# EAGLE design fpv2 (EAGLE 8.4.2)

## Sheet 1 of 2
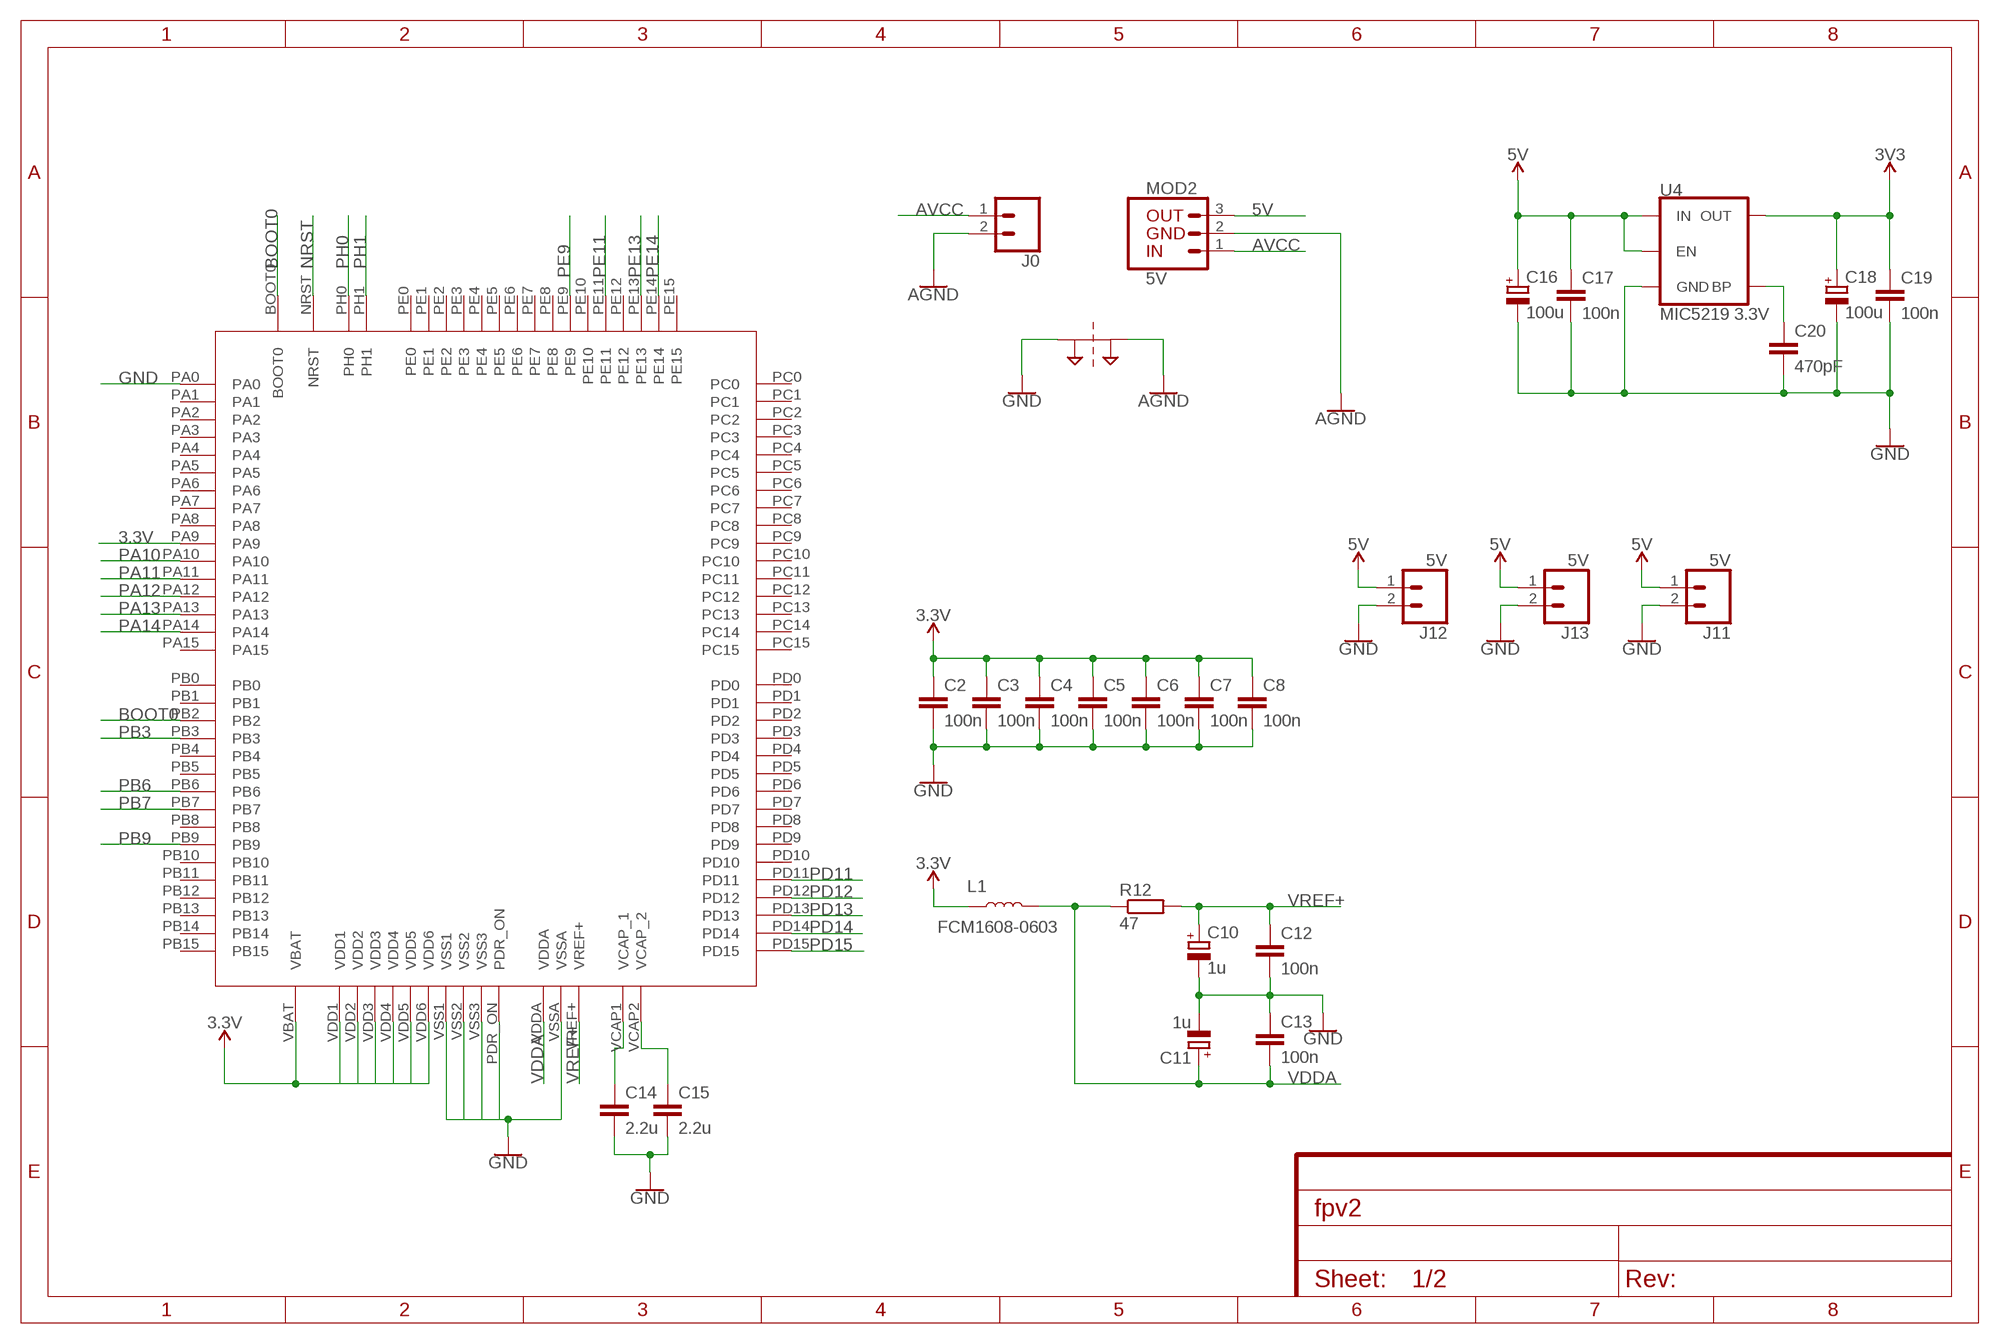
[diagram p0: schematic, sheet 1]

### Parts
C2  100n  C-EUC0603  [C0603]
C3  100n  C-EUC0603  [C0603]
C4  100n  C-EUC0603  [C0603]
C5  100n  C-EUC0603  [C0603]
C6  100n  C-EUC0603  [C0603]
C7  100n  C-EUC0603  [C0603]
C8  100n  C-EUC0603  [C0603]
C10  1u  CPOL-EUA/3216-18R  [A/3216-18R]
C11  1u  CPOL-EUA/3216-18R  [A/3216-18R]
C12  100n  C-EUC0603  [C0603]
C13  100n  C-EUC0603  [C0603]
C14  2.2u  C-EUC1206  [C1206]
C15  2.2u  C-EUC1206  [C1206]
C16  100u  CPOL-EUSMCB  [SMC_B]
C17  100n  C-EUC0603  [C0603]
C18  100u  CPOL-EUSMCB  [SMC_B]
C19  100n  C-EUC0603  [C0603]
C20  470pF  C-EUC0603  [C0603]
J0  CONN_02LOCK_LONGPADS  [1X02_LOCK_LONGPADS]
J11  5V  CONN-02SMD  [SMD]
J12  5V  CONN-02SMD  [SMD]
J13  5V  CONN-02SMD  [SMD]
L1  FCM1608-0603  INDUCTOR-0603-33NH  [0603]
MOD2  5V  TPS-MODULE  [1X03]
R12  47  R-EU_R0603  [R0603]
SUPPLY1  2PT_GND_TIE  [2PT_GND_TIE]
U1  STM32F407VGT6  STM32F4V_100PIN_GENERIC  [LQFP100]
U4  MIC5219 3.3V  V_REG_MIC52193.3V  [SOT23-5]

### Nets
3.3V: C2.1 C3.1 C4.1 C5.1 C6.1 C7.1 C8.1 C18.+ C19.1 L1.1 U1.PA9 U1.VBAT U1.VDD1 U1.VDD2 U1.VDD3 U1.VDD4 U1.VDD5 U1.VDD6 U4.5(OUT) ; supply symbol labelled 3V3 ; also sheet 2
5V: C16.+ C17.1 J11.1 J12.1 J13.1 MOD2.3 U4.1(IN) U4.3(EN) ; also sheet 2
AGND: J0.2 MOD2.2 SUPPLY1.P$2 ; also sheet 2
AVCC: J0.1 MOD2.1 ; also sheet 2
BOOT0: U1.BOOT0 U1.PB2 ; also sheet 2
GND: C2.2 C3.2 C4.2 C5.2 C6.2 C7.2 C8.2 C10.- C11.- C12.2 C13.1 C14.2 C15.2 C16.- C17.2 C18.- C19.2 C20.2 J11.2 J12.2 J13.2 SUPPLY1.P$1 U1.PA0 U1.PDR_ON U1.VSS1 U1.VSS2 U1.VSS3 U1.VSSA U4.2(GND) ; also sheet 2
N$9: C14.1 U1.VCAP1(VCAP_1)
N$10: C15.1 U1.VCAP2(VCAP_2)
N$14: C20.1 U4.4(BP)
NRST: U1.NRST ; also sheet 2
PA10: U1.PA10
PA11: U1.PA11 ; also sheet 2
PA12: U1.PA12 ; also sheet 2
PA13: U1.PA13 ; also sheet 2
PA14: U1.PA14 ; also sheet 2
PB3: U1.PB3 ; also sheet 2
PB6: U1.PB6 ; also sheet 2
PB7: U1.PB7 ; also sheet 2
PB9: U1.PB9 ; also sheet 2
PD11: U1.PD11 ; also sheet 2
PD12: U1.PD12 ; also sheet 2
PD13: U1.PD13 ; also sheet 2
PD14: U1.PD14 ; also sheet 2
PD15: U1.PD15 ; also sheet 2
PE9: U1.PE9 ; also sheet 2
PE11: U1.PE11 ; also sheet 2
PE13: U1.PE13 ; also sheet 2
PE14: U1.PE14 ; also sheet 2
PH0: U1.PH0 ; also sheet 2
PH1: U1.PH1 ; also sheet 2
VDDA: C11.+ C13.2 L1.2 R12.1 U1.VDDA
VREF+: C10.+ C12.1 R12.2 U1.VREF+
Unconnected: U1.PA1 U1.PA2 U1.PA3 U1.PA4 U1.PA5 U1.PA6 U1.PA7 U1.PA8 U1.PA15 U1.PB0 U1.PB1 U1.PB4 U1.PB5 U1.PB8 U1.PB10 U1.PB11 U1.PB12 U1.PB13 U1.PB14 U1.PB15 U1.PC0 U1.PC1 U1.PC2 U1.PC3 U1.PC4 U1.PC5 U1.PC6 U1.PC7 U1.PC8 U1.PC9 U1.PC10 U1.PC11 U1.PC12 U1.PC13 U1.PC14 U1.PC15 U1.PD0 U1.PD1 U1.PD2 U1.PD3 U1.PD4 U1.PD5 U1.PD6 U1.PD7 U1.PD8 U1.PD9 U1.PD10 U1.PE0 U1.PE1 U1.PE2 U1.PE3 U1.PE4 U1.PE5 U1.PE6 U1.PE7 U1.PE8 U1.PE10 U1.PE12 U1.PE15

## Sheet 2 of 2
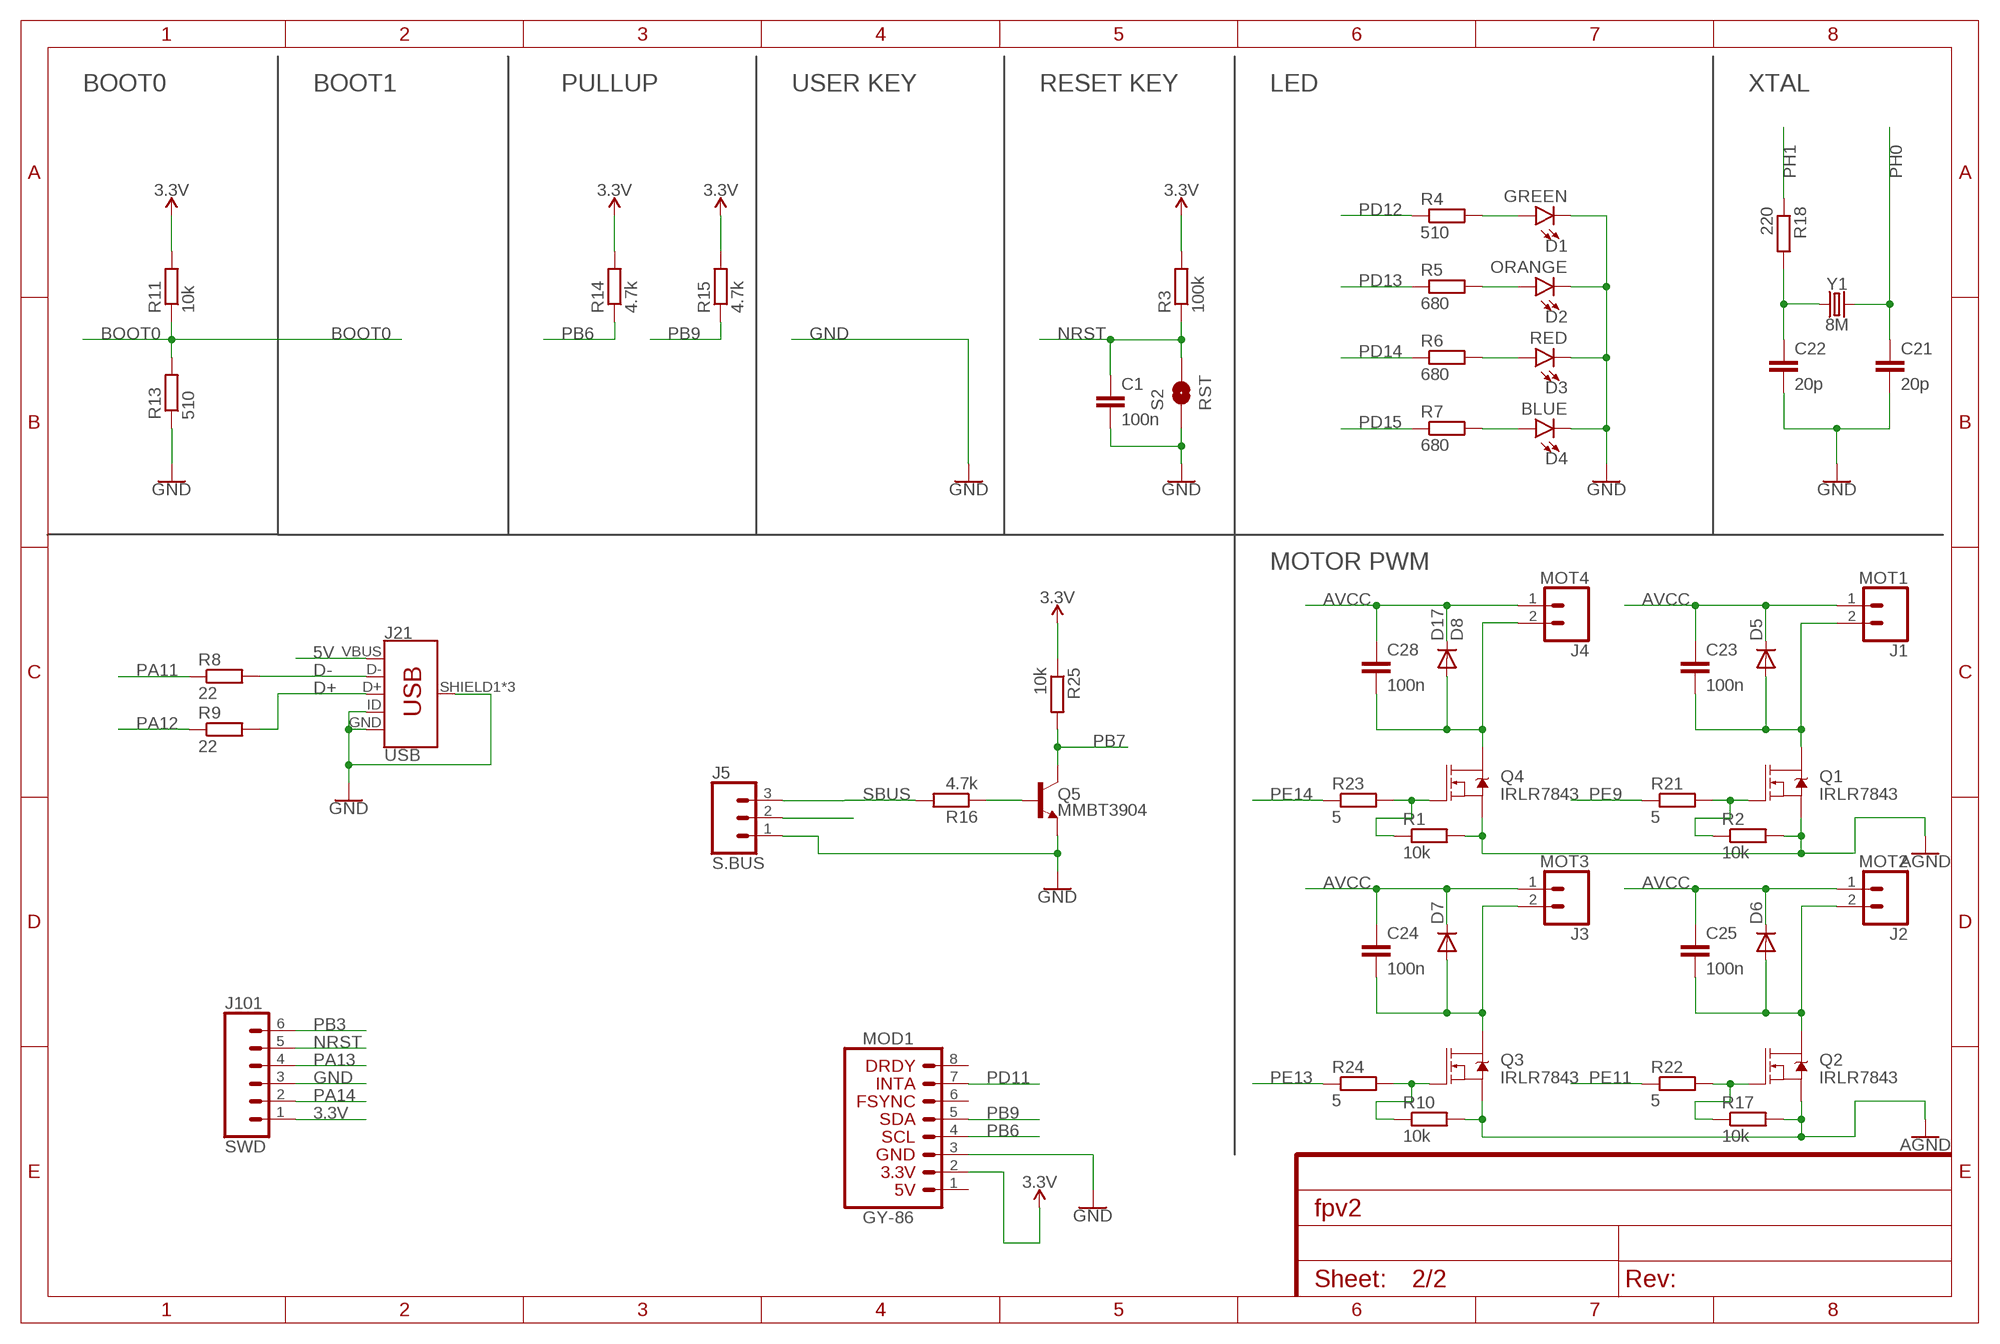
[diagram p1: schematic, sheet 2]

### Parts
C1  100n  C-EUC0603  [C0603]
C21  20p  C-EUC0603  [C0603]
C22  20p  C-EUC0603  [C0603]
C23  100n  C-EUC0603  [C0603]
C24  100n  C-EUC0603  [C0603]
C25  100n  C-EUC0603  [C0603]
C28  100n  C-EUC0603  [C0603]
D1  GREEN  LED0603  [LED-0603]
D2  ORANGE  LED0603  [LED-0603]
D3  RED  LED0603  [LED-0603]
D4  BLUE  LED0603  [LED-0603]
D5  DIODE-DO214AC  [DO214AC]
D6  DIODE-DO214AC  [DO214AC]
D7  DIODE-DO214AC  [DO214AC]
D17  D8  DIODE-DO214AC  [DO214AC]
J1  MOT1  CONN_02LOCK_LONGPADS  [1X02_LOCK_LONGPADS]
J2  MOT2  CONN_02LOCK_LONGPADS  [1X02_LOCK_LONGPADS]
J3  MOT3  CONN_02LOCK_LONGPADS  [1X02_LOCK_LONGPADS]
J4  MOT4  CONN_02LOCK_LONGPADS  [1X02_LOCK_LONGPADS]
J5  S.BUS  CONN_03  [1X03]
J21  USB  USB_MICRO-B_FEMALE-SMT  [USB-B-MICRO-SMD]
J101  SWD  CONN_06SMD-FEMALE-V2  [1X06-SMD-FEMALE]
MOD1  GY-86  [GY-86]
Q1  IRLR7843  MOSFET-NCH-FDD8780  [DPAK]
Q2  IRLR7843  MOSFET-NCH-FDD8780  [DPAK]
Q3  IRLR7843  MOSFET-NCH-FDD8780  [DPAK]
Q4  IRLR7843  MOSFET-NCH-FDD8780  [DPAK]
Q5  MMBT3904  TRANS_NPN-MMBT2222AL  [SOT23-3]
R1  10k  R-EU_R0603  [R0603]
R2  10k  R-EU_R0603  [R0603]
R3  100k  R-EU_R0603  [R0603]
R4  510  R-EU_R0603  [R0603]
R5  680  R-EU_R0603  [R0603]
R6  680  R-EU_R0603  [R0603]
R7  680  R-EU_R0603  [R0603]
R8  22  R-EU_R0603  [R0603]
R9  22  R-EU_R0603  [R0603]
R10  10k  R-EU_R0603  [R0603]
R11  10k  R-EU_R0603  [R0603]
R13  510  R-EU_R0603  [R0603]
R14  4.7k  R-EU_R0603  [R0603]
R15  4.7k  R-EU_R0603  [R0603]
R16  4.7k  R-EU_R0603  [R0603]
R17  10k  R-EU_R0603  [R0603]
R18  220  R-EU_R0603  [R0603]
R21  5  R-EU_R0603  [R0603]
R22  5  R-EU_R0603  [R0603]
R23  5  R-EU_R0603  [R0603]
R24  5  R-EU_R0603  [R0603]
R25  10k  R-EU_R0603  [R0603]
S2  RST  JUMPER-SMT_2_NO_NO-SILK  [SMT-JUMPER_2_NO_NO-SILK]
Y1  8M  CRYSTALSMD-5X3.2-2PAD  [CRYSTAL-SMD-5X3.2-2PAD]

### Nets
3.3V: J101.1 MOD1.2(3.3V) R3.2 R11.2 R14.2 R15.2 R25.1 ; also sheet 1
5V: J5.2 J21.VBUS ; also sheet 1
AGND: Q1.3(S) Q2.3(S) Q3.3(S) Q4.3(S) R1.2 R2.2 R10.2 R17.2 ; also sheet 1
AVCC: C23.1 C24.1 C25.1 C28.1 D5.C D6.C D7.C D17.C J1.1 J2.1 J3.1 J4.1 ; also sheet 1
BOOT0: R11.1 R13.2 ; also sheet 1
D+: J21.D+ R9.2
D-: J21.D- R8.2
GND: C1.2 C21.2 C22.2 D1.C D2.C D3.C D4.C J5.1 J21.GND J21.ID J21.SHIELD1(SHIELD) J21.SHIELD2(SHIELD) J21.SHIELD3(SHIELD) J101.3 MOD1.3(GND) Q5.2(E) R13.1 S2.1 ; also sheet 1
N$2: C23.2 D5.A J1.2 Q1.4(D)
N$3: D1.A R4.2
N$4: D2.A R5.2
N$5: D3.A R6.2
N$6: D4.A R7.2
N$7: C25.2 D6.A J2.2 Q2.4(D)
N$8: Q4.1(G) R1.1 R23.2
N$12: Q1.1(G) R2.1 R21.2
N$13: C22.1 R18.2 Y1.P$1
N$15: Q3.1(G) R10.1 R24.2
N$16: C28.2 D17.A J4.2 Q4.4(D)
N$17: Q2.1(G) R17.1 R22.2
N$19: Q5.1(B) R16.1
N$21: C24.2 D7.A J3.2 Q3.4(D)
NRST: C1.1 J101.5 R3.1 S2.2 ; also sheet 1
PA11: R8.1 ; also sheet 1
PA12: R9.1 ; also sheet 1
PA13: J101.4 ; also sheet 1
PA14: J101.2 ; also sheet 1
PB3: J101.6 ; also sheet 1
PB6: MOD1.4(SCL) R14.1 ; also sheet 1
PB7: Q5.3(C) R25.2 ; also sheet 1
PB9: MOD1.5(SDA) R15.1 ; also sheet 1
PD11: MOD1.7(INTA) ; also sheet 1
PD12: R4.1 ; also sheet 1
PD13: R5.1 ; also sheet 1
PD14: R6.1 ; also sheet 1
PD15: R7.1 ; also sheet 1
PE9: R21.1 ; also sheet 1
PE11: R22.1 ; also sheet 1
PE13: R24.1 ; also sheet 1
PE14: R23.1 ; also sheet 1
PH0: C21.1 Y1.P$2 ; also sheet 1
PH1: R18.1 ; also sheet 1
SBUS: J5.3 R16.2
Unconnected: MOD1.1(5V) MOD1.6(FSYNC) MOD1.8(DRDY)

### Notes on the sheet
- BOOT0 | BOOT1 | PULLUP | USER KEY | RESET KEY | LED | XTAL
- MOTOR PWM

## Library data of the parts
C1-C8 C12-C15 C17 C19-C25 C28 = rcl:C-EU: CAPACITOR, European symbol
C10 C11 C16 C18 = rcl:CPOL-EU: POLARIZED CAPACITOR, European symbol
D1-D4 = SparkFun-LED:LED: LED (Generic) Standard schematic elements and footprints for 5mm, 3mm, 1206, and 0603 sized LEDs. Generic LEDs with no color specified.
D5-D7 D17 = diode:DIODE-: DIODE
J0 J1-J4 = SparkFun-Connectors:CONN_02: Multi connection point. Often used as Generic Header-pin footprint for 0.1 inch spaced/style header connections On any of the 0.1 inch spaced packages, you can populate with these: Break Away Headers - Straight (PRT-00116) Break Away Male Headers - Right Angle (PRT-00553) Female Headers (PRT-00115) Break Away Headers - Machine Pin (PRT-00117) Break Away Female Headers - Swiss Machine Pin (PRT-00743) For SCREWTERMINALS and SPRING TERMINALS visit here: Screw Terimnals on SparkFun.com (5mm/3.5mm/2.54mm spacing) This device is also useful as a general connection point to wire up your design to another part of your project. Our various solder wires solder well into these plated through hole pads. Hook-Up Wire - Assortment (Stranded, 22 AWG) (PRT-11375) Hook-Up Wire - Assortment (Solid Core, 22 AWG) (PRT-11367) View the entire wire category on our website here Special notes: Molex polarized connector foot print use with: PRT-08233 with associated crimp pins and housings. 2.54_SCREWTERM for use with PRT-10571. 3.5mm Screw Terminal footprints for PRT-08084 5mm Screw Terminal footprints for use with PRT-08432
J5 = SparkFun-Connectors:CONN_03: Multi connection point. Often used as Generic Header-pin footprint for 0.1 inch spaced/style header connections On any of the 0.1 inch spaced packages, you can populate with these: Break Away Headers - Straight (PRT-00116) Break Away Male Headers - Right Angle (PRT-00553) Female Headers (PRT-00115) Break Away Headers - Machine Pin (PRT-00117) Break Away Female Headers - Swiss Machine Pin (PRT-00743) Stackable Header - 3 Pin (Female, 0.1") (PRT-13875) For SCREWTERMINALS and SPRING TERMINALS visit here: Screw Terimnals on SparkFun.com (5mm/3.5mm/2.54mm spacing) This device is also useful as a general connection point to wire up your design to another part of your project. Our various solder wires solder well into these plated through hole pads. Hook-Up Wire - Assortment (Stranded, 22 AWG) (PRT-11375) Hook-Up Wire - Assortment (Solid Core, 22 AWG) (PRT-11367) View the entire wire category on our website here Special notes: Molex polarized connector foot print use with SKU : PRT-08232 with associated crimp pins and housings.
J11-J13 = CONN-02:CONN-02
J21 = SparkFun-Connectors:USB_MICRO-B: USB Type Micro-B Connector Male/female and PTH/SMT variants SparkFun Products: SparkFun microB USB Breakout <https://www.sparkfun.com/products/12035> SparkFun USB microB Plug Breakout <https://www.sparkfun.com/products/10031> SparkFun ESP8266 Thing <https://www.sparkfun.com/products/13231>; PROD_ID: CONN-11752
J101 = SparkFun-Connectors:CONN_06: Multi connection point. Often used as Generic Header-pin footprint for 0.1 inch spaced/style header connections On any of the 0.1 inch spaced packages, you can populate with these: Break Away Headers - Straight (PRT-00116) Break Away Male Headers - Right Angle (PRT-00553) Female Headers (PRT-00115) Break Away Headers - Machine Pin (PRT-00117) Break Away Female Headers - Swiss Machine Pin (PRT-00743) Arduino Stackable Header - 6 Pin (PRT-09280) For SCREWTERMINALS and SPRING TERMINALS visit here: Screw Terimnals on SparkFun.com (5mm/3.5mm/2.54mm spacing) This device is also useful as a general connection point to wire up your design to another part of your project. Our various solder wires solder well into these plated through hole pads. Hook-Up Wire - Assortment (Stranded, 22 AWG) (PRT-11375) Hook-Up Wire - Assortment (Solid Core, 22 AWG) (PRT-11367) View the entire wire category on our website here; PROD_ID: CONN-09668
L1 = SparkFun-Coils:INDUCTOR: Inductors Resist changes in electrical current. Basically a coil of wire. SparkFun Products: SparkFun Load Cell Amplifier - HX711 IOIO-OTG - V2.2; PROD_ID: NDUC-07874; VALUE: 33nH/±5%/500mA
MOD1 = GY-86:GY-86
MOD2 = TPS-MODULE:TPS-MODULE
Q1-Q4 = SparkFun-DiscreteSemi:MOSFET-NCH: N-channel MOSFETs Voltage controlled devices that allow control of high current outputs. SparkFun Products: SparkFun OpenScale <https://www.sparkfun.com/products/13261> SparkFun Digital Sandbox <https://www.sparkfun.com/products/12651> SparkFun Monster Moto Shield <https://www.sparkfun.com/products/10182> SparkFun MOSFET Power Controller <https://www.sparkfun.com/products/11214>; PROD_ID: TRANS-09984; VALUE: 35A/25V/8.5mΩ
Q5 = SparkFun-DiscreteSemi:TRANS_NPN: NPN transistor Current controlled devices typically used to amplify current or used as a switch. BC547 - COM-08928 (TO-92 45V 100mA) (1.Collector 2.Base 3.Emitter) 2N3904 - COM-00521 (TO-92 40V 200mA) (1.Emitter 2.Base 3.Collector) P2N2222A - COM-12852 (TO-92 40V 600mA) (1.Collector 2.Base 3.Emitter); PROD_ID: TRANS-08049; VALUE: 600mA/40V
R1-R18 R21-R25 = rcl:R-EU_: RESISTOR, European symbol
S2 = SparkFun-Jumpers:JUMPER-SMT_2_NO: Normally open jumper This jumper has two pads in close proximity to each other. Apply solder to close the connection. Round pads are easier to solder for beginners, but are a lot larger. SparkFun Product that uses the round pads: SparkFun EL Sequencer
SUPPLY1 = SparkFun-PowerSymbols:2PT_GND_TIE: Dual Ground Supply Power supply symbol for connecting two grounds. SparkFun Products: SparkFun AutoDriver - Stepper Motor Driver
U1 = stm32f4:STM32F4V_100PIN_GENERIC
U4 = SparkFun-IC-Power:V_REG_MIC5219: V_REG MIC5219 Standard 3.3V and 5V 500mA LDO voltage regulator in SOT-23 layout. Micrel part MIC5219. BP (by-pass) pin is used to lower output noise with 470pF cap, may be left open.; PROD_ID: VREG-09872
Y1 = SparkFun-Clocks:CRYSTAL: Crystals (Generic) These are passive quartz crystals, which can be used as a clock source for a microcontroller. Crystal's are two-terminal devices. They require external "load" capacitors to generate an oscillating signal.

## Net classes
0 default: clearance 0.205 mm

## Board
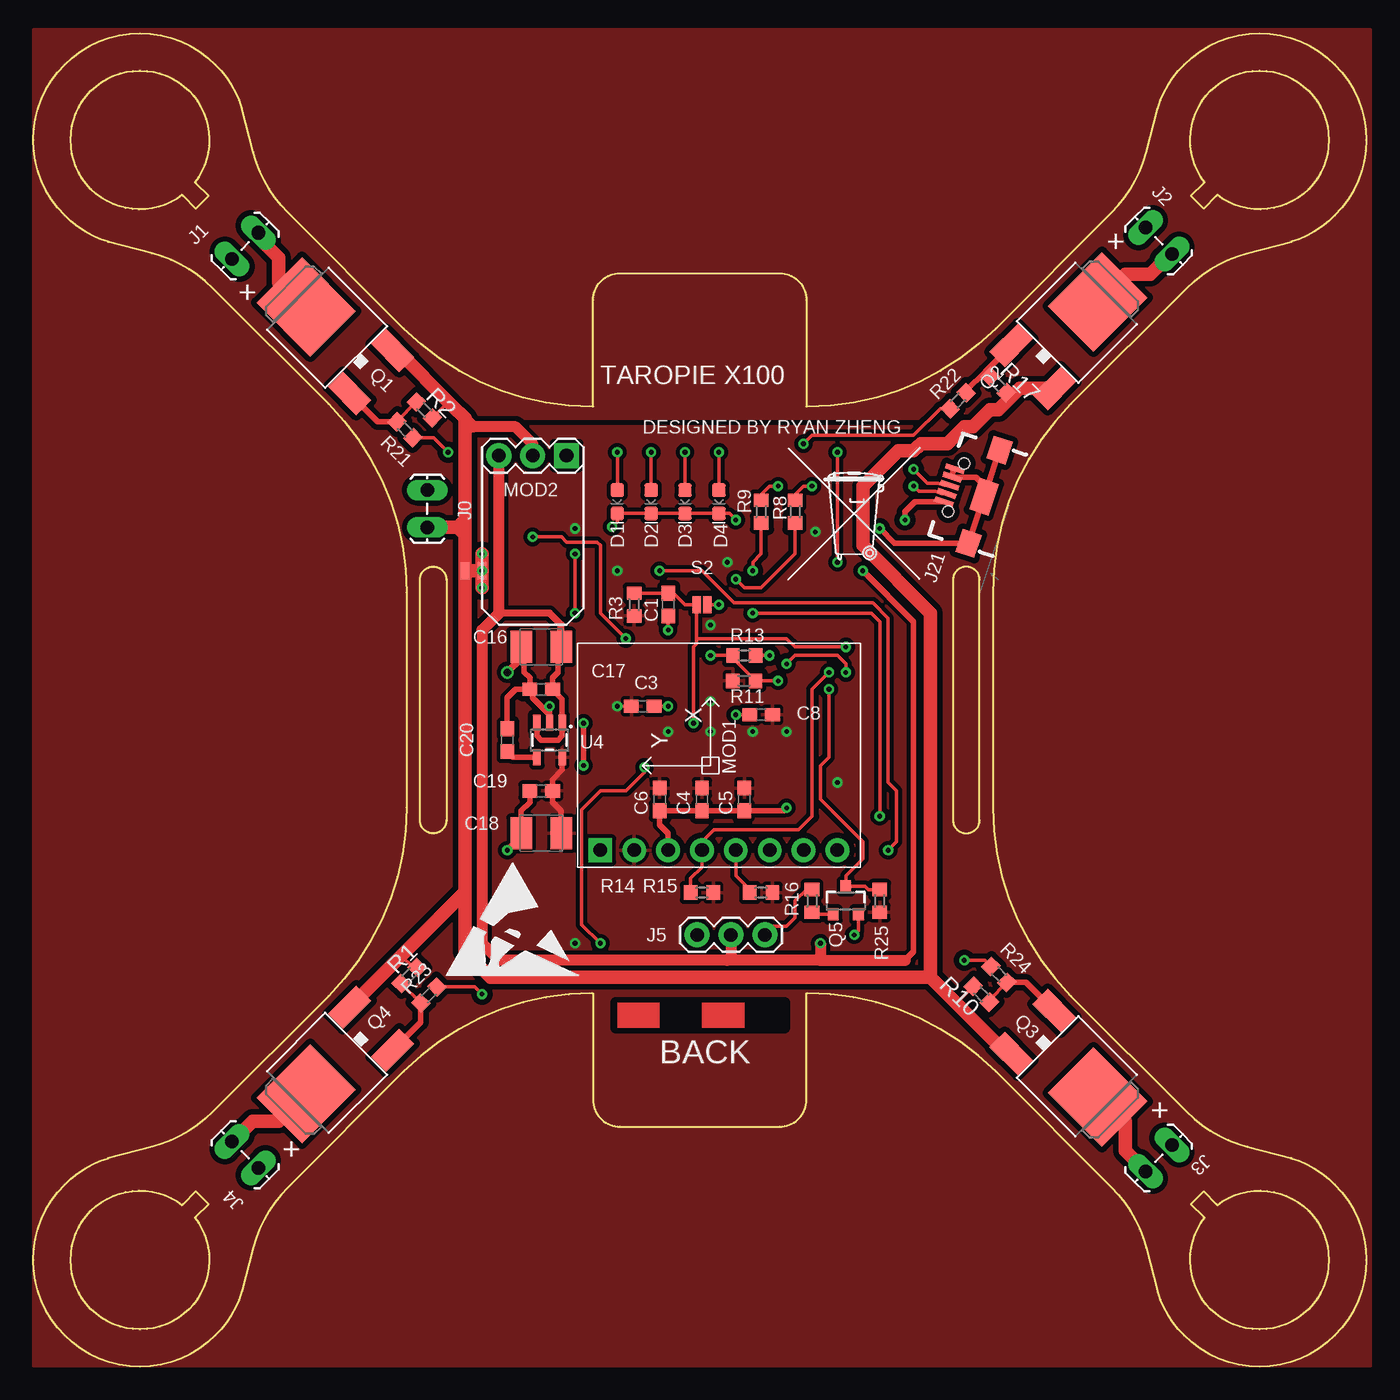
[diagram p2: board, top side]
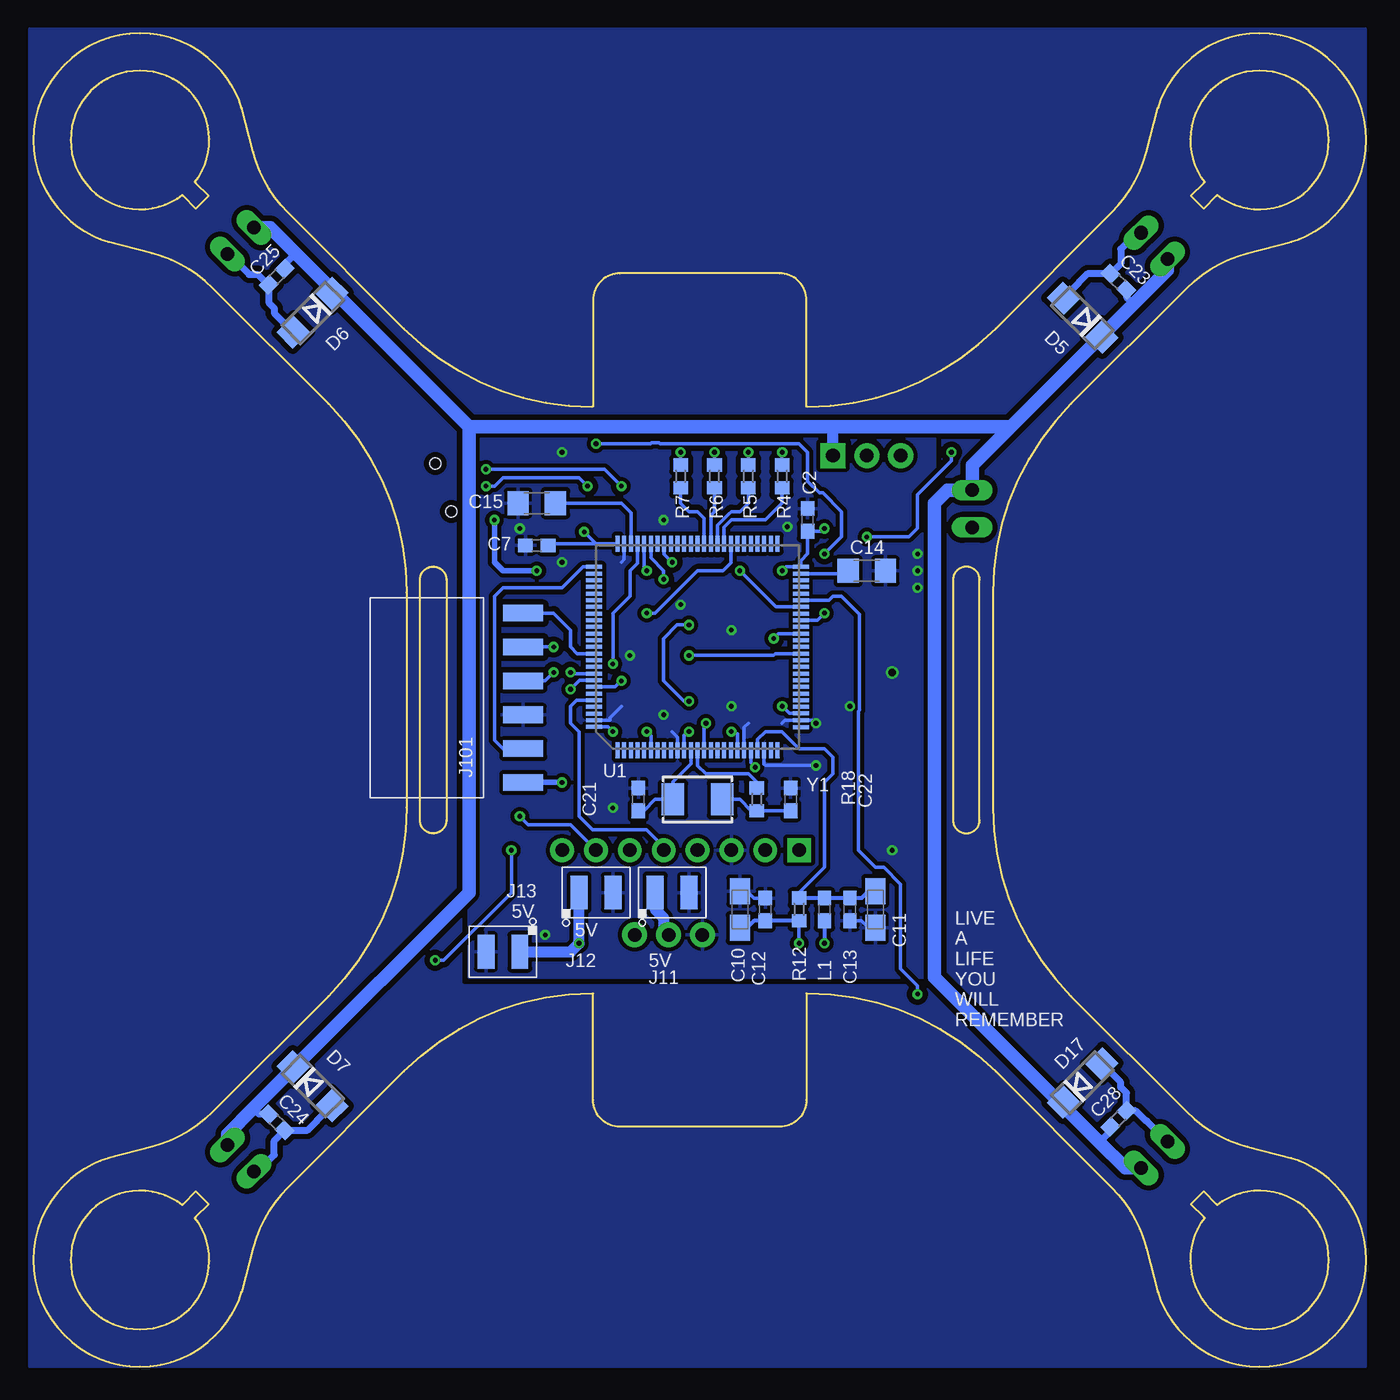
[diagram p3: board, bottom side, seen from below]

Size 100 x 100 mm. Coordinates in mm from the lower left corner, seen from the top.
Outline: 92 segments
Copper layers (1*16): Top 0.035mm / dielectric 1.5mm / Bottom 0.035mm
Design rules "default *": minimum track width 8mil, minimum drill 0.3mm, track to track 8mil, track to pad 8mil, pad to pad 8mil, via to via 8mil, smd to smd 6mil, copper to edge 0mil, drill to drill 12mil, minimum pad ring 10mil, minimum via ring 8mil, stop-mask expansion 4mil, vias tented up to drill 20mil, thermal gap 10mil
tRestrict: area 43.7,25.4 to 56.4,27.3

### Footprints (pad centres in the part's own frame; a part is rotated, then mirrored left to right if it is on the bottom)
C0603 = smd 1.1 x 1: 1 -0.85,0; 2 0.85,0
A/3216-18R = smd 1.95 x 1.5: + 1.375,0; - -1.375,0
C1206 = smd 1.6 x 1.8: 1 -1.4,0; 2 1.4,0
SMC_B = smd 1.6 x 2.4: + -1.5,0; - 1.5,0
LED-0603 = smd 1 x 1: A -0.877,0; C 0.877,0
DO214AC = smd 1.8 x 1.7: A 2.05,0; C -2.05,0
1X02_LOCK_LONGPADS = drill 1.016 long: 1 -0.127,0; 2 2.667,0
1X03 = drill 1.016 pad 1.88: 1 0,0; 2 2.54,0; 3 5.08,0
SMD = smd 1.27 x 2.54: 1 0,0; 2 2.54,0
USB-B-MICRO-SMD = smd 1.45 x 0.4: D+ 2.725,0; D- 2.725,0.65; GND 2.725,-1.3; ID 2.725,-0.65; VBUS 2.725,1.3 | smd 1.5 x 1.8: SHIELD1 0,3.685; SHIELD2 0,-3.685 | smd 1.5 x 2.5: SHIELD3 0,0 | hole 0.85: 2.2,1.9; 2.2,-1.9
1X06-SMD-FEMALE = smd 1.25 x 3: 1 6.35,3.425; 2 3.81,3.425; 3 1.27,3.425; 4 -1.27,3.425; 5 -3.81,3.425; 6 -6.35,3.425
0603 = smd 1.1 x 1: 1 -0.85,0; 2 0.85,0
GY-86 = drill 1.02 pad 1.778 square: 1 1.27,8.89 | drill 1.02 pad 1.778: 2 1.27,6.35; 3 1.27,3.81; 4 1.27,1.27; 5 1.27,-1.27; 6 1.27,-3.81; 7 1.27,-6.35; 8 1.27,-8.89
1X03' = drill 1.016 pad 1.88 square: 1 0,0 | drill 1.016 pad 1.88: 2 2.54,0; 3 5.08,0
DPAK = smd 1.6 x 3: 1 -2.28,-5.31; 3 2.28,-5.31 | smd 4.826 x 5.715: 4 0,1.588
SOT23-3 = smd 0.8 x 0.9: 1 -0.95,-1; 2 0.95,-1; 3 0,1.1
R0603 = smd 1 x 1.1: 1 -0.85,0; 2 0.85,0
SMT-JUMPER_2_NO_NO-SILK = smd 0.635 x 1.27: 1 -0.406,0; 2 0.406,0
2PT_GND_TIE = smd 1.27 x 0.635: P$1 0,0.635; P$2 0,-0.635
LQFP100 = smd 1.2 x 0.3: BOOT0 -7.75,-3; PA3 7.75,-6.016; PA4 7.75,-4.5; PA5 7.75,-4; PA6 7.75,-3.5; PA7 7.75,-3; PA14 -7.75,6; PA15 -7.75,5.5; PB0 7.75,-1.5; PB1 7.75,-1; PB2 7.75,-0.5; PB3 -7.75,-0.5; PB4 -7.75,-1; PB5 -7.75,-1.5; PB6 -7.75,-2; PB7 -7.75,-2.5; PB8 -7.75,-3.5; PB9 -7.75,-4; PB10 7.75,4.5; PB11 7.75,5; PC4 7.75,-2.5; PC5 7.75,-2; PC10 -7.75,5; PC11 -7.75,4.5; PC12 -7.75,4; PD0 -7.75,3.5; PD1 -7.75,3; PD2 -7.75,2.5; PD3 -7.75,2; PD4 -7.75,1.5; PD5 -7.75,1; PD6 -7.75,0.5; PD7 -7.75,0; PDR_ON -7.75,-5.5; PE0 -7.75,-4.5; PE1 -7.75,-5; PE7 7.75,0; PE8 7.75,0.5; PE9 7.75,1; PE10 7.75,1.5; PE11 7.75,2; PE12 7.75,2.5; PE13 7.75,3; PE14 7.75,3.5; PE15 7.75,4; VCAP1 7.75,5.5; VDD3 7.75,-4.984; VDD4 7.75,6; VDD6 -7.75,-6; VSS2 7.75,-5.5 | smd 0.3 x 1.2: NRST 0.5,-7.75; PA0 5,-7.75; PA1 5.5,-7.75; PA2 6,-7.75; PA8 -2,7.75; PA9 -2.5,7.75; PA10 -3,7.75; PA11 -3.5,7.75; PA12 -4,7.75; PA13 -4.5,7.75; PB12 6,7.75; PB13 5.5,7.75; PB14 5,7.75; PB15 4.5,7.75; PC0 1,-7.75; PC1 1.5,-7.75; PC2 2,-7.75; PC3 2.5,-7.75; PC6 0,7.75; PC7 -0.5,7.75; PC8 -1,7.75; PC9 -1.5,7.75; PC13 -3,-7.75; PC14 -2.5,-7.75; PC15 -2,-7.75; PD8 4,7.75; PD9 3.5,7.75; PD10 3,7.75; PD11 2.5,7.75; PD12 2,7.75; PD13 1.5,7.75; PD14 1,7.75; PD15 0.5,7.75; PE2 -6,-7.75; PE3 -5.5,-7.75; PE4 -5,-7.75; PE5 -4.5,-7.75; PE6 -4,-7.75; PH0 -0.5,-7.75; PH1 0,-7.75; VBAT -3.5,-7.75; VCAP2 -5,7.75; VDD1 -1,-7.75; VDD2 3,-7.75; VDD5 -6,7.75; VDDA 4.5,-7.75; VREF+ 4,-7.75; VSS1 -1.5,-7.75; VSS3 -5.5,7.75; VSSA 3.5,-7.75
SOT23-5 = smd 0.55 x 1.2: 1 -0.95,-1.3; 2 0,-1.3; 3 0.95,-1.3; 4 0.95,1.3; 5 -0.95,1.3
CRYSTAL-SMD-5X3.2-2PAD = smd 1.7 x 2.4: P$1 1.85,0; P$2 -1.85,0

### Placement (x,y rotation side)
C1  47.63,57.15 270 top
C2  41.91,63.5 90 bottom
C3  45.72,49.53 0 top
C4  50.17,42.55 270 top
C5  53.34,42.55 270 top
C6  46.99,42.55 270 top
C7  62.23,61.6 180 bottom
C8  54.61,48.9 180 top
C10  46.99,34.29 270 bottom
C11  36.83,34.29 90 bottom
C12  45.09,34.29 90 bottom
C13  38.74,34.29 90 bottom
C14  37.47,59.69 0 bottom
C15  62.23,64.77 180 bottom
C16  38.1,53.98 180 top
C17  38.1,50.8 180 top
C18  38.1,40.01 180 top
C19  38.1,43.18 180 top
C20  35.56,46.99 90 top
C21  54.61,42.55 90 bottom
C22  43.18,42.55 90 bottom
C23  18.59,81.36 135 bottom
C24  81.74,18.33 315 bottom
C25  81.74,81.74 225 bottom
C28  18.59,18.59 45 bottom
D1  43.82,64.87 270 top
D2  46.36,64.87 270 top
D3  48.9,64.87 270 top
D4  51.44,64.87 270 top
D5  21.28,78.67 135 bottom
D6  79.05,79.05 225 bottom
D7  79.05,21.03 315 bottom
D17  21.28,21.28 45 bottom
J0  29.56,65.61 270 top
J1  15,83.16 45 top
J2  83.54,85.33 315 top
J3  85.33,16.54 225 top
J4  16.79,15 135 top
J5  49.8,32.39 0 top
J11  53.34,35.56 0 bottom
J12  59.06,35.56 0 bottom
J13  63.5,31.12 180 bottom
J21  71.32,65.24 161.6 top
J101  66.68,50.17 270 bottom
L1  40.64,34.29 90 bottom
MOD1  51.44,37.47 90 top
MOD2  5V  [1X03']  40.01,68.33 180 top
Q1  21.59,78.36 45 top
Q2  78.74,78.74 315 top
Q3  78.74,21.34 225 top
Q4  21.59,21.59 135 top
Q5  60.96,34.93 0 top
R1  28.19,29.34 45 top
R2  29.34,71.76 315 top
R3  45.09,57.15 270 top
R4  43.82,66.77 90 bottom
R5  46.36,66.77 90 bottom
R6  48.9,66.77 90 bottom
R7  51.44,66.77 90 bottom
R8  57.15,64.14 90 top
R9  54.61,64.14 90 top
R10  71.12,27.94 135 top
R11  53.34,51.44 180 top
R12  42.55,34.29 270 bottom
R13  53.34,53.34 180 top
R14  50.17,35.56 0 top
R15  54.61,35.56 0 top
R16  58.42,34.93 90 top
R17  72.39,73.66 315 top
R18  45.72,42.55 270 bottom
R21  27.88,70.28 135 top
R22  69.39,72.45 45 top
R23  29.67,27.88 225 top
R24  72.45,29.42 315 top
R25  63.5,34.93 90 top
S2  50.17,57.15 180 top
SUPPLY1  33.02,59.69 270 top
U1  50.17,53.98 0 bottom
U4  38.74,46.99 180 top
U$1  [TONNE_10.00]  61.47,61.98 0 top
U$2  [ESD_10.00]  30.86,29.21 0 top
Y1  50.17,42.55 0 bottom

### Tracks (layer width: path | path; a pad name or v marks a point on that pad's centre or on a via)
3.3V  (via drill 0.35)
  Top 0.254: v43.82,49.53 C3.1
  Top 0.406: U4.5 39.69,44.77 38.95,44.03 C19.1 38.95,42.33 39.6,41.68 C18.+
  Bottom 0.254: U1.VDD5 57.79,61.73 | 57.79,61.73 61.25,61.73 C7.1 | U1.VDD3 43.28,48.99 v43.82,49.53 | v40.64,62.87 40.86,62.65 C2.1 41.91,60.96 42.42,60.46 U1.VDD4 43.53,59.98 v43.82,59.69 | U1.VDD2 47.17,47.45 v47.63,47.63 | U1.VDD1 51.17,47.36 v50.8,47.63 | U1.VBAT 53.67,47.32 v53.98,47.63 | U1.VDD6 56.88,47.98 56.71,47.8 56.69,47.8 v56.52,47.63 | v50.8,49.91 51.18,49.91 52.71,51.44 52.71,54.61 51.69,55.63 v50.8,55.63 | 57.79,61.73 v58.67,62.61 | U1.PA9 52.67,60.92 v52.07,60.33
  Bottom 0.305: L1.1 v40.64,31.75
  Bottom 0.406: J101.1 v60.33,43.82
  pour Top (isolate 0.305, rank 2): 32.39,70.49 32.39,29.21 67.31,29.21 67.31,70.49
5V  (via drill 0.35)
  Top 0.406: C16.+ 39.37,53.75 39.37,52.07 38.95,51.65 C17.1 39.69,50.07 U4.1 39.69,47.31 39.37,46.99 38.1,46.99 37.79,47.31 U4.3 | 65.41,30.48 66.04,31.12 66.04,55.88 v62.23,59.69 | v65.41,63.5 65.41,64.14 66.14,64.87 J21.VBUS
  Top 0.508: C16.+ 39.6,55.65 38.74,56.52 34.93,56.52
  Top 0.813: MOD2.3 34.93,56.52 33.66,55.25 33.66,31.75 34.93,30.48 52.07,30.48 | 59.06,30.48 65.41,30.48 | 59.06,30.48 52.07,30.48 | J5.2 52.34,30.75 52.07,30.48 | v59.06,31.75 59.06,30.48
  Bottom 0.406: v62.23,59.69 64.77,59.69 65.41,60.33 v65.41,63.5
  Bottom 0.813: J11.1 53.34,34.29 52.71,33.66 52.71,32.75 J5.2 | J12.1 v59.06,31.75 59.69,31.12 J13.1
AGND
  Top 0.254: R17.2 | R17.2 73.34,72.71 | R2.2 30.86,72.07 31.43,72.07 | R1.2 28.48,29.94 27.6,30.82 | R10.2 69.28,27.31 69.22,27.31
  Top 0.813: MOD2.2 37.47,69.22 36.2,70.49 33.02,70.49 32.39,71.12
  Top 1.016: 31.83,62.94 32.39,63.5 | 32.39,63.5 32.39,71.12 31.43,72.07 27.29,76.22 Q1.3 | 32.39,63.5 32.39,35.61 | 32.39,35.61 27.6,30.82 Q4.3 | 32.39,35.61 32.39,31.12 34.29,29.21 67.31,29.21 | 67.31,29.21 69.22,27.31 73.66,22.86 73.66,23.19 Q3.3 | J0.2 31.83,62.94 | SUPPLY1.P$2 32.39,62.39 31.83,62.94 | Q2.3 74.01,73.37 73.34,72.71 72.39,71.76 71.76,71.76 70.49,70.49 69.85,70.49 68.58,69.22 66.59,69.22 66.39,69.01 66.34,69.01 66.04,68.71 64.9,68.71 62.23,66.04 62.23,61.6 67.31,56.52 67.31,29.21
AVCC
  Bottom 0.508: C25.1 81.14,82.69 80.33,83.5 | D6.C 77.6,80.77 77.79,80.96 | C23.1 17.99,80.22 17.46,79.69 | D5.C 19.89,77.27 | D7.C 80.5,22.37 80.65,22.23 | C24.1 83.07,18.94 83.5,19.37 | D17.C 22.73,19.81 22.86,19.69 | C28.1 19.19,17.64 20,16.83
  Bottom 0.813: MOD2.1 40.01,70.49
  Bottom 1.016: 26.67,70.49 40.01,70.49 67.31,70.49 | 67.31,70.49 67.31,35.56 80.65,22.23 83.5,19.37 85.42,17.45 J3.1 | 26.67,70.49 29.56,67.6 J0.1 31.42,65.74 32.39,64.77 32.39,29.21 22.86,19.69 20,16.83 18.08,14.91 J4.1 | J2.1 82.25,85.42 80.33,83.5 77.79,80.96 67.31,70.49 | J1.1 14.91,82.25 17.46,79.69 19.89,77.27 26.67,70.49
BOOT0  (via drill 0.35)
  Top 0.254: v55.88,51.44 R11.1 52.49,53.13 R13.2 v50.8,53.34
  Bottom 0.254: U1.BOOT0 56.34,50.98 v55.88,51.44 | v50.8,53.34 44.45,53.34 44.32,53.48 U1.PB2
D+  (via drill 0.35)
  Top 0.254: J21.D+ 68.36,66.1 67.88,66.26 67.09,66.26 v66.04,67.31 | v55.88,66.04 55.25,66.04 54.61,65.41 R9.2
  Bottom 0.254: v66.04,67.31 57.15,67.31 v55.88,66.04
D-  (via drill 0.35)
  Top 0.254: J21.D- 68.16,65.49 67.68,65.65 66.43,65.65 v66.04,66.04 | v58.42,66.04 57.79,66.04 57.15,65.41 R8.2
  Bottom 0.254: v66.04,66.04 65.41,66.04 64.77,66.68 59.06,66.68 v58.42,66.04
GND  (via drill 0.35, 0.55)
  Top 0.254: R13.1 v55.25,53.34 | S2.1 v51.44,57.15 | C1.2 v47.63,55.25 | v52.71,63.5 52.22,63.99 D4.C D3.C D2.C D1.C 43.82,63.37 v43.43,62.99 | 71.54,65.9 J21.SHIELD3 | C3.2 v47.63,49.53 | C8.2 v52.71,48.9 | Q5.2 61.91,32.7 v61.6,32.39 | 68.94,66.84 J21.ID | v60.33,68.58 v60.33,60.33
  Top 0.406: C17.2 37.25,51.65 36.83,52.07 36.83,53.75 C16.- | C17.2 37.47,50.59 37.47,50.17 38.74,48.9 U4.2 v38.74,49.53 | C20.2 35.56,50.17 36.2,50.8 C17.2 | C19.2 37.25,42.33 36.6,41.68 C18.- 36.6,39.78 v35.56,38.74 | J21.SHIELD3 J21.SHIELD1 64.62,61.75 v63.5,62.87 | J21.SHIELD2 71.54,65.9 70.72,66.72 J21.ID | v56.52,41.91 56.3,41.7 C5.2 C4.2 C6.2 46.99,40.64 47.63,40.01 MOD1.3 | v41.28,45.09 v41.28,48.26 | 68.94,66.84 arc-45 J21.GND
  Top 0.508: C16.- 36.6,53.11 v35.56,52.07
  Top 1.016: v33.66,60.96 SUPPLY1.P$1 | SUPPLY1.P$1 v33.66,58.42 | SUPPLY1.P$1 32.39,59.69
  Bottom 0.254: C13.1 37.89,33.44 37.36,32.92 C11.- | C12.2 45.94,35.14 46.36,35.56 46.89,35.56 C10.- | U1.PDR_ON 56.73,48.48 56.73,48.68 55.88,49.53 | 43.82,48.26 43.6,48.48 U1.VSS2 41.49,48.48 v41.28,48.26 | U1.PA0 45.17,45.18 45.08,45.09 41.28,45.09 v41.28,45.09 | U1.VSSA 46.67,47.95 46.36,48.26 | U1.VSS3 55.67,60.54 55.88,60.33 | U1.VSS1 51.67,47.22 52.07,47.63
  other vias: 33.66,59.69
  pour Bottom (isolate 0.305, rank 2): 32.39,70.49 32.39,29.21 67.31,29.21 67.31,70.49
N$2
  Top 1.016: Q1.4 20.21,79.48 18.42,81.28 18.42,83.19 16.88,84.72 J1.2
  Bottom 0.508: J1.2 17.19,85.04 18.42,83.82 18.42,82.74 C23.2 20.91,81.96 21.59,81.28 21.59,81.26 D5.A
N$3  (via drill 0.35)
  Top 0.254: D1.A v43.82,68.58
  Bottom 0.254: v43.82,68.58 R4.2
N$4  (via drill 0.35)
  Top 0.254: D2.A v46.36,68.58
  Bottom 0.254: v46.36,68.58 R5.2
N$5  (via drill 0.35)
  Top 0.254: D3.A v48.9,68.58
  Bottom 0.254: v48.9,68.58 R6.2
N$6  (via drill 0.35)
  Top 0.254: D4.A v51.44,68.58
  Bottom 0.254: v51.44,68.58 R7.2
N$7
  Top 1.016: Q2.4 81.92,81.92 83.82,81.92 85.35,83.45 J2.2
  Bottom 0.508: J2.2 85.35,83.45 83.82,81.92 83.19,81.92 82.55,81.28 82.48,81.28 C25.2 82.34,79.8 81.92,79.38 81.92,79.02 D6.A
N$8
  Top 0.254: R1.1 27.61,28.74 R23.2
  Top 0.406: R23.2 29.07,25.85 Q4.1
N$9
  Bottom 0.254: U1.VCAP1 39.08,59.48 C14.1
N$10
  Bottom 0.254: U1.VCAP2 55.17,64.06 55.88,64.77 C15.1
N$12
  Top 0.254: R2.1 27.28,70.9 R21.2
  Top 0.406: R21.2 25.85,70.88 Q1.1
N$13
  Bottom 0.254: Y1.P$1 46.99,42.55 46.14,41.7 R18.2 C22.1
N$14
  Top 0.406: U4.4 36.01,45.69 C20.1
N$15
  Top 0.254: R10.1 71.72,27.48 R24.2
  Top 0.406: R24.2 74.48,28.82 Q3.1
N$16
  Top 1.016: Q4.4 18.42,18.42 16.44,18.42 J4.2
  Bottom 0.508: J4.2 16.44,18.42 16.51,18.42 17.28,19.19 C28.2 17.99,20.53 18.42,20.96 18.42,21.31 D17.A
N$17
  Top 0.254: R17.1 | R17.1 71.41,74.64
  Top 0.406: Q2.1 71.41,74.64 69.99,73.21 R22.2
N$19
  Top 0.254: Q5.1 58.57,33.93 R16.1
N$21
  Top 1.016: Q3.4 80.12,20.21 81.92,18.42 81.92,16.19 J3.2
  Bottom 0.508: J3.2 83.14,14.65 81.92,15.88 81.92,16.96 C24.2 79.42,17.73 78.74,18.42 78.74,18.44 D7.A
N$101
  pour Top (isolate 0.406, rank 3): 0,0 0,99.7 0,100.33 100.33,100.33 100.33,0
N$102
  pour Bottom (isolate 0.406, rank 3): 0,0 0,100.33 100.33,100.33 100.33,0
NRST  (via drill 0.35)
  Top 0.254: R3.1 C1.1 48.05,58 48.9,57.15 S2.2 49.76,54.61 | 49.76,54.61 49.76,54.2 49.53,53.98 v49.53,48.26 | v60.96,53.98 57.15,53.98 56.52,54.61 49.76,54.61
  Bottom 0.254: U1.NRST 49.67,48.13 v49.53,48.26 | J101.5 v60.96,53.98
PA11  (via drill 0.35)
  Top 0.254: R8.1 57.15,60.96 54.61,58.42 53.34,58.42 v52.71,59.06
  Bottom 0.254: U1.PA11 53.67,60.65 52.71,59.69 v52.71,59.06
PA12  (via drill 0.35)
  Top 0.254: v53.98,59.69 53.98,60.33 54.61,60.96 R9.1
  Bottom 0.254: U1.PA12 54.17,59.88 v53.98,59.69
PA13  (via drill 0.35)
  Top 0.254: v60.96,52.07 60.96,52.71 60.33,53.34 57.15,53.34 v56.52,52.71
  Bottom 0.254: J101.4 61.6,51.44 v60.96,52.07 | v56.52,52.71 56.52,56.52 55.25,57.79 55.25,59.69 54.67,60.27 U1.PA13
PA14
  Bottom 0.254: J101.2 64.77,46.36 65.41,46.99 65.41,57.79 64.77,58.42 60.33,58.42 58.77,59.98 U1.PA14
PB3
  Bottom 0.254: J101.6 60.96,56.52 59.69,55.25 59.69,53.98 59.19,53.48 U1.PB3
PB6  (via drill 0.35)
  Top 0.254: v59.69,52.07 58.42,50.8 58.42,41.28 57.4,40.26 51.05,40.26 50.8,40.01 50.17,39.37 MOD1.4 50.17,37.47 49.32,36.62 R14.1
  Bottom 0.254: U1.PB6 59.6,51.98 v59.69,52.07
PB7  (via drill 0.35)
  Top 0.254: R25.2 62.65,35.78 62.4,36.03 Q5.3 60.96,36.83 62.23,38.1 62.23,39.37 59.06,42.55 59.06,45.09 59.69,45.72 v59.69,50.8
  Bottom 0.254: U1.PB7 59.02,51.48 v59.69,50.8
PB9
  Top 0.254: R15.1 53.76,35.78 52.71,36.83 MOD1.5
  Bottom 0.254: MOD1.5 52.71,38.99 53.98,40.26 58.04,40.26 59.06,41.28 59.06,47.63 59.69,48.26 59.69,49.53 59.25,49.98 U1.PB9
PD11  (via drill 0.35)
  Top 0.254: v63.5,41.28 63.5,55.88 62.87,56.52 v53.98,56.52
  Bottom 0.254: MOD1.7 59.69,40.64 62.87,40.64 v63.5,41.28 | v53.98,56.52 53.34,56.52 50.17,59.69 48.26,59.69 47.67,60.29 U1.PD11
PD12
  Bottom 0.254: U1.PD12 48.17,62.96 47.63,63.5 45.09,63.5 43.82,64.77 R4.1
PD13
  Bottom 0.254: U1.PD13 48.67,63.11 47.82,63.96 47.8,63.96 47.63,64.14 46.99,64.14 46.36,64.77 R5.1
PD14
  Bottom 0.254: U1.PD14 49.17,63.87 48.9,64.14 R6.1
PD15
  Bottom 0.254: U1.PD15 49.67,63.64 50.17,64.14 50.8,64.14 51.44,64.77 R7.1
PE9  (via drill 0.35)
  Top 0.254: R21.1 30.02,69.68 v31.12,68.58 | v37.47,62.23 39.62,62.23 40.01,61.85 42.29,61.85 42.55,61.6 42.55,56.52 v44.45,54.61
  Bottom 0.254: U1.PE9 44.09,54.98 v44.45,54.61 | v37.47,62.23 34.29,62.23 33.66,62.87 33.66,65.41 31.12,67.95 v31.12,68.58
PE11  (via drill 0.35)
  Top 0.254: v40.64,60.96 v40.64,56.52 | R22.1 68.04,71.85 66.04,69.85 58.42,69.85 v57.79,69.22
  Bottom 0.254: v57.79,69.22 53.71,69.22 53.63,69.29 53.05,69.29 52.97,69.22 42.55,69.22 41.91,68.58 41.91,66.42 41.02,65.53 40.77,65.53 39.37,64.14 39.37,62.23 v40.64,60.96 | U1.PE11 41.18,55.98 v40.64,56.52
PE13  (via drill 0.35)
  Top 0.254: v46.99,59.69 50.17,59.69 52.58,57.28 62.99,57.28 64.14,56.13 64.14,43.82 64.77,43.18 64.77,39.37 v64.14,38.74 | v69.85,30.48 71.39,30.48 R24.1
  Bottom 0.254: U1.PE13 44.28,56.98 v46.99,59.69 | v64.14,38.74 64.14,35.56 69.22,30.48 v69.85,30.48
PE14  (via drill 0.35)
  Top 0.254: R23.1 33.12,28.48 v33.66,27.94
  Bottom 0.254: v33.66,27.94 33.66,28.58 34.93,29.85 34.93,36.2 36.2,37.47 36.83,37.47 38.1,38.74 38.1,49.16 38.03,49.24 38.03,56.44 39.37,57.79 40.01,57.79 40.32,57.48 U1.PE14
PH0
  Bottom 0.254: U1.PH0 50.67,45.22 52.02,43.87 Y1.P$2 53.34,42.55 54.19,41.7 C21.1
PH1
  Bottom 0.254: R18.1 45.72,43.82 46.36,44.45 49.53,44.45 50.17,45.09 U1.PH1
SBUS
  Top 0.254: R16.2 58,35.78 57.15,34.93 57.15,33.66 56.52,33.02 55.52,33.02 J5.3
VDDA
  Bottom 0.254: R12.1 42.55,35.56 40.64,37.47 40.64,43.82 40.01,44.45 40.01,45.72 40.64,46.36 42.55,46.36 43.82,47.63 45.09,47.63 45.67,47.05 U1.VDDA
  Bottom 0.305: C11.+ 36.94,35.56 37.47,35.56 37.89,35.14 C13.2 L1.2 R12.1
VREF+  (via drill 0.35)
  Top 0.254: v45.85,44.96 45.85,44.58 44.45,43.18 42.55,43.18 41.15,41.78 41.15,33.15 v42.55,31.75
  Bottom 0.254: U1.VREF+ 46.17,45.28 v45.85,44.96 | v42.55,31.75 R12.2
  Bottom 0.305: R12.2 C12.1 45.94,33.44 46.36,33.02 46.89,33.02 C10.+
(copper drawn outside any net)
  shapes: Top area x2

### Text on the board
tPlace: + | + | TAROPIE X100 | DESIGNED BY RYAN ZHENG | BACK | + | +
bPlace: LIVE / A / LIFE / YOU / WILL / REMEMBER
tStop: FRONT | DO NOT FLY IN / POPULATED AREA